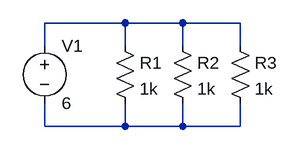
[diagram p0: schematic Draft1.asc]
Draft1.asc, the LTspice schematic file:
Version 4
SHEET 1 880 680
WIRE 128 80 16 80
WIRE 208 80 128 80
WIRE 288 80 208 80
WIRE 16 112 16 80
WIRE 128 112 128 80
WIRE 208 112 208 80
WIRE 288 112 288 80
WIRE 16 224 16 192
WIRE 128 224 128 192
WIRE 128 224 16 224
WIRE 208 224 208 192
WIRE 208 224 128 224
WIRE 288 224 288 192
WIRE 288 224 208 224
SYMBOL voltage 16 96 R0
SYMATTR InstName V1
SYMATTR Value 6
SYMBOL res 112 96 R0
SYMATTR InstName R1
SYMATTR Value 1k
SYMBOL res 192 96 R0
SYMATTR InstName R2
SYMATTR Value 1k
SYMBOL res 272 96 R0
SYMATTR InstName R3
SYMATTR Value 1k

The netlist it stands for:
* Draft1.asc
V1 N001 N002 6
R1 N001 N002 1k
R2 N001 N002 1k
R3 N001 N002 1k
.backanno
.end